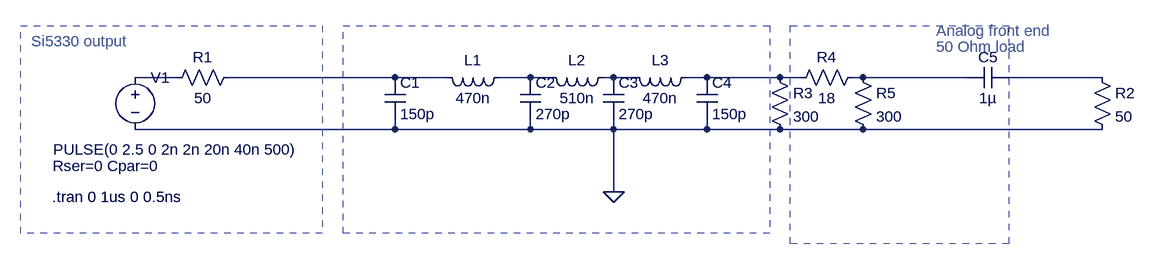
[diagram p0: schematic cheb_7ord.asc]
cheb_7ord.asc, the LTspice schematic file:
Version 4
SHEET 1 1240 680
WIRE -240 16 -304 16
WIRE 96 16 -160 16
WIRE 176 16 96 16
WIRE 304 16 256 16
WIRE 336 16 304 16
WIRE 432 16 416 16
WIRE 464 16 432 16
WIRE 576 16 544 16
WIRE 688 16 576 16
WIRE 720 16 688 16
WIRE 816 16 800 16
WIRE 976 16 816 16
WIRE 1184 16 1040 16
WIRE 96 96 96 80
WIRE 96 96 -304 96
WIRE 304 96 304 80
WIRE 304 96 96 96
WIRE 432 96 432 80
WIRE 432 96 304 96
WIRE 576 96 576 80
WIRE 576 96 432 96
WIRE 688 96 576 96
WIRE 816 96 688 96
WIRE 1184 96 816 96
WIRE 432 192 432 96
FLAG 432 192 0
SYMBOL ind 272 0 R90
WINDOW 0 5 56 VBottom 2
WINDOW 3 32 56 VTop 2
SYMATTR InstName L1
SYMATTR Value 470n
SYMATTR SpiceLine Ipk=0.1 Rser=0.5
SYMBOL cap 80 16 R0
SYMATTR InstName C1
SYMATTR Value 150p
SYMATTR SpiceLine Rser=2
SYMBOL cap 288 16 R0
SYMATTR InstName C2
SYMATTR Value 270p
SYMATTR SpiceLine Rser=2
SYMBOL cap 416 16 R0
SYMATTR InstName C3
SYMATTR Value 270p
SYMATTR SpiceLine Rser=2
SYMBOL ind 432 0 R90
WINDOW 0 5 56 VBottom 2
WINDOW 3 32 56 VTop 2
SYMATTR InstName L2
SYMATTR Value 510n
SYMATTR SpiceLine Ipk=0.1 Rser=0.5
SYMBOL res 1168 0 R0
SYMATTR InstName R2
SYMATTR Value 50
SYMBOL voltage -304 0 R0
WINDOW 123 0 0 Left 0
WINDOW 39 -127 152 Left 2
WINDOW 3 -126 127 Left 2
SYMATTR SpiceLine Rser=0 Cpar=0
SYMATTR Value PULSE(0 2.5 0 2n 2n 20n 40n 500)
SYMATTR InstName V1
SYMBOL cap 560 16 R0
SYMATTR InstName C4
SYMATTR Value 150p
SYMATTR SpiceLine Rser=2
SYMBOL ind 560 0 R90
WINDOW 0 5 56 VBottom 2
WINDOW 3 32 56 VTop 2
SYMATTR InstName L3
SYMATTR Value 470n
SYMATTR SpiceLine Ipk=0.1 Rser=0.5
SYMBOL res -144 0 R90
WINDOW 0 0 56 VBottom 2
WINDOW 3 32 56 VTop 2
SYMATTR InstName R1
SYMATTR Value 50
SYMBOL res 672 0 R0
SYMATTR InstName R3
SYMATTR Value 300
SYMBOL res 816 0 R90
WINDOW 0 0 56 VBottom 2
WINDOW 3 32 56 VTop 2
SYMATTR InstName R4
SYMATTR Value 18
SYMBOL res 800 0 R0
SYMATTR InstName R5
SYMATTR Value 300
SYMBOL cap 1040 0 R90
WINDOW 0 0 32 VBottom 2
WINDOW 3 32 32 VTop 2
SYMATTR InstName C5
SYMATTR Value 1µ
TEXT -432 200 Left 2 !.tran 0 1us 0 0.5ns
TEXT -464 -40 Left 2 ;Si5330 output
TEXT 928 -32 Left 2 ;50 Ohm load
TEXT 928 -56 Left 2 ;Analog front end
RECTANGLE Normal -16 256 -480 -64 2
RECTANGLE Normal 672 256 16 -64 2
RECTANGLE Normal 1040 272 704 -64 2

The netlist it stands for:
* cheb_7ord.asc
L1 N003 N002 470n Ipk=0.1 Rser=0.5
C1 N002 0 150p Rser=2
C2 N003 0 270p Rser=2
C3 N004 0 270p Rser=2
L2 N004 N003 510n Ipk=0.1 Rser=0.5
R2 N007 0 50
V1 N001 0 PULSE(0 2.5 0 2n 2n 20n 40n 500) Rser=0 Cpar=0
C4 N005 0 150p Rser=2
L3 N005 N004 470n Ipk=0.1 Rser=0.5
R1 N002 N001 50
R3 N005 0 300
R4 N006 N005 18
R5 N006 0 300
C5 N007 N006 1µ
.tran 0 1us 0 0.5ns
* Si5330 output
* 50 Ohm load
* Analog front end
.backanno
.end